# EAGLE design E-Piano-SM (EAGLE 9.2.2)
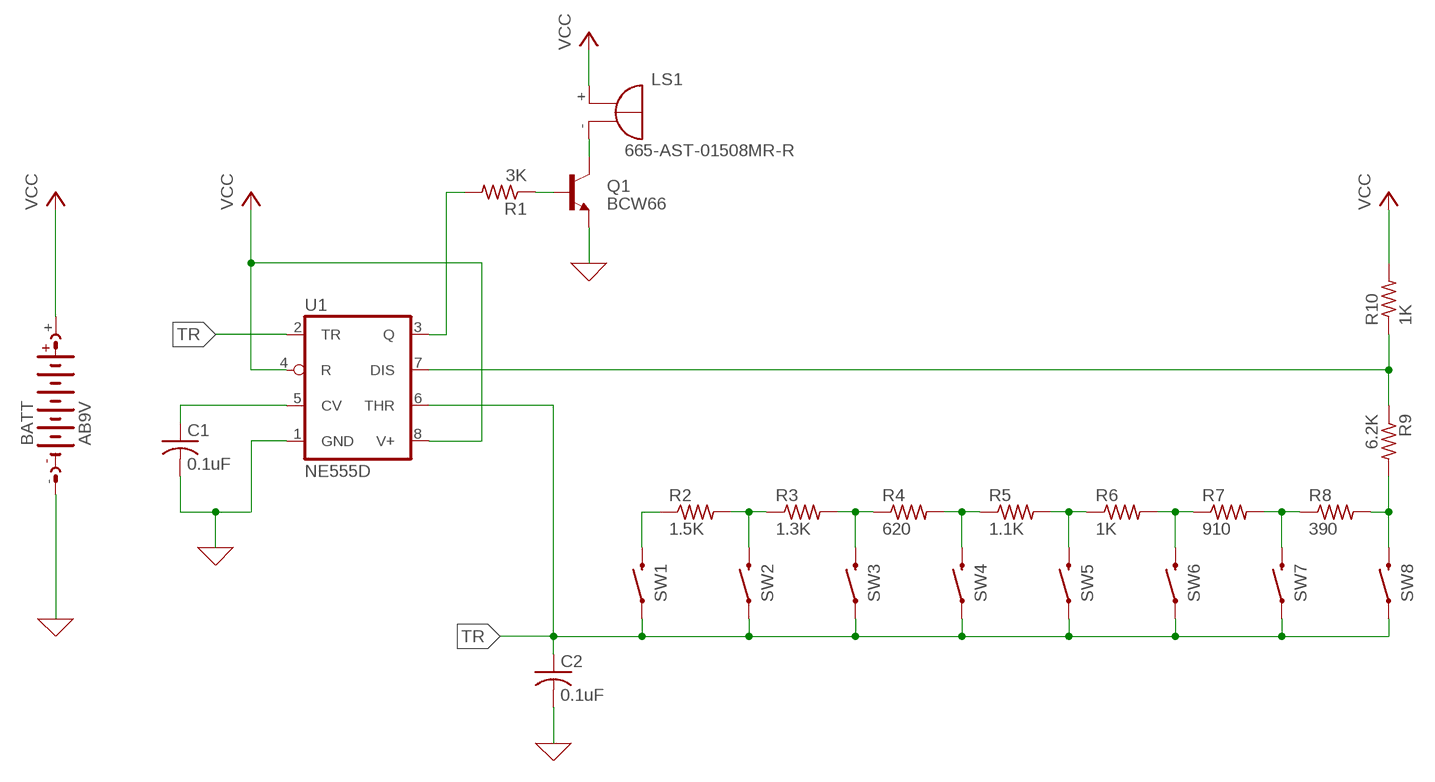
[diagram p0: schematic, sheet 1]

## Parts
BATT  AB9V  [AB9V]
C1  0.1uF  C-USC0805  [C0805]
C2  0.1uF  C-USC0805  [C0805]
LS1  F/HMB  [F/HMB]
Q1  BCW66  BCW60-NPN-SOT23-BEC  [SOT23-BEC]
R1  3K  R-US_R0805  [R0805]
R2  1.5K  R-US_R0805  [R0805]
R3  1.3K  R-US_R0805  [R0805]
R4  620  R-US_R0805  [R0805]
R5  1.1K  R-US_R0805  [R0805]
R6  1K  R-US_R0805  [R0805]
R7  910  R-US_R0805  [R0805]
R8  390  R-US_R0805  [R0805]
R9  6.2K  R-US_R0805  [R0805]
R10  1K  R-US_R0805  [R0805]
SW1  MOMENTARY-SWITCH-SPST-SMD-6.2MM-TALL  [TACTILE_SWITCH_SMD_6.2MM_TALL]
SW2  MOMENTARY-SWITCH-SPST-SMD-6.2MM-TALL  [TACTILE_SWITCH_SMD_6.2MM_TALL]
SW3  MOMENTARY-SWITCH-SPST-SMD-6.2MM-TALL  [TACTILE_SWITCH_SMD_6.2MM_TALL]
SW4  MOMENTARY-SWITCH-SPST-SMD-6.2MM-TALL  [TACTILE_SWITCH_SMD_6.2MM_TALL]
SW5  MOMENTARY-SWITCH-SPST-SMD-6.2MM-TALL  [TACTILE_SWITCH_SMD_6.2MM_TALL]
SW6  MOMENTARY-SWITCH-SPST-SMD-6.2MM-TALL  [TACTILE_SWITCH_SMD_6.2MM_TALL]
SW7  MOMENTARY-SWITCH-SPST-SMD-6.2MM-TALL  [TACTILE_SWITCH_SMD_6.2MM_TALL]
SW8  MOMENTARY-SWITCH-SPST-SMD-6.2MM-TALL  [TACTILE_SWITCH_SMD_6.2MM_TALL]
U1  NE555D  [SO08]

## Nets
0: BATT.- C1.2 C2.2 Q1.E U1.1(GND) ; supply symbol labelled GND
N$1: R8.2 R9.2 SW8.B2
N$2: R9.1 R10.1 U1.7(DIS)
N$3: R2.1 SW1.B2
N$4: R7.2 R8.1 SW7.B2
N$5: R6.2 R7.1 SW6.B2
N$6: R5.2 R6.1 SW5.B2
N$7: R4.2 R5.1 SW4.B2
N$8: R3.2 R4.1 SW3.B2
N$9: R2.2 R3.1 SW2.B2
N$11: R1.2 U1.3(Q)
N$12: C1.1 U1.5(CV)
N$13: LS1.- Q1.C
N$14: Q1.B R1.1
TR: C2.1 SW1.A2 SW2.A2 SW3.A2 SW4.A2 SW5.A2 SW6.A2 SW7.A2 SW8.A2 U1.2(TR) U1.6(THR)
VCC: BATT.+ LS1.+ R10.2 U1.4(R) U1.8(V+)

## Library data of the parts
BATT = battery:AB9V: 9-V BATTERY CLIP; MOUSER#: 534-81-8TB; MPN: 81-8; OC_NEWARK: unknown
C1 C2 = rcl:C-US: CAPACITOR, American symbol; MOUSER#: 603-CC805JRX7R9BB104; MPN: CC805JRX7R9BB104; OC_NEWARK: unknown; SPICEPREFIX: C
LS1 = buzzer:F/HMB: BUZZER Source: Buerklin; MOUSER#: 665-AST-01508MR-R; OC_FARNELL: unknown; OC_NEWARK: unknown
Q1 = transistor:*-NPN-: NPN Transistror BF959 corrected 2008.03.06; MF: FAIRCHILD SEMICONDUCTOR; MOUSER#: 726-BCW66KHE6327HTSA; MPN: PN2222ATF; OC_NEWARK: 58K2048
R1 R6 R10 = rcl:R-US_: RESISTOR, American symbol; MOUSER#: 652-CR0805FX-1001ELF; OC_NEWARK: unknown; SPICEPREFIX: R
R2 = rcl:R-US_: RESISTOR, American symbol; MOUSER#: 652-CR0805FX-1501ELF; OC_NEWARK: unknown; SPICEPREFIX: R
R3 = rcl:R-US_: RESISTOR, American symbol; MOUSER#: 652-CR0805JW-132ELF; OC_NEWARK: unknown; SPICEPREFIX: R
R4 = rcl:R-US_: RESISTOR, American symbol; MOUSER#: 652-CR0805JW-621ELF; OC_NEWARK: unknown; SPICEPREFIX: R
R5 = rcl:R-US_: RESISTOR, American symbol; MOUSER#: 652-CR0805FX-1101ELF; OC_NEWARK: unknown; SPICEPREFIX: R
R7 = rcl:R-US_: RESISTOR, American symbol; MOUSER#: 652-CR0805FX-9100ELF; OC_NEWARK: unknown; SPICEPREFIX: R
R8 = rcl:R-US_: RESISTOR, American symbol; MOUSER#: 652-CR0805JW-391ELF; OC_NEWARK: unknown; SPICEPREFIX: R
R9 = rcl:R-US_: RESISTOR, American symbol; MOUSER#: 652-CR0805FX-6201ELF; OC_NEWARK: unknown; SPICEPREFIX: R
SW1-SW8 = SparkFun-Switches:MOMENTARY-SWITCH-SPST: Momentary Switch (Pushbutton) - SPST Normally-open (NO) SPST momentary switches (buttons, pushbuttons). Variants PTH-12MM - 12mm square, through-hole Momentary Pushbutton Switch - 12mm Square <https://www.sparkfun.com/products/9190> (COM-09190) PTH-6.0MM, PTH-6.0MM-KIT - 6.0mm square, through-hole Mini Pushbutton Switch <https://www.sparkfun.com/products/97> (COM-00097) KIT package intended for soldering kit's - only one side of pads' copper is exposed. PTH-RIGHT-ANGLE-KIT - Right-angle, through-hole Right Angle Tactile Button <https://www.sparkfun.com/products/10791> - Used on SparkFun BigTime Watch Kit <https://www.sparkfun.com/products/11734> SMD-12MM - 12mm square, surface-mount Tactile Button - SMD (12mm) <https://www.sparkfun.com/products/12993> (COM-12993) Used on SparkFun PicoBoard <https://www.sparkfun.com/products/11888> SMD-4.5MM - 4.5mm Square Trackball Switch Used on SparkFun Blackberry Trackballer Breakout <https://www.sparkfun.com/products/13169> SMD-4.6MMX2.8MM - 4.60mm x 2.80mm, surface mount Used on SparkFun SAMD21 Mini Breakout <https://www.sparkfun.com/products/13664> SMD-5.2MM, SMD-5.2-REDUNDANT - 5.2mm square, surface-mount Mini Pushbutton Switch - SMD <https://www.sparkfun.com/products/8720> (COM-08720) Used on Arduino Pro Mini <https://www.sparkfun.com/products/11114> REDUNDANT package connects both switch circuits together SMD-6.0X3.5MM - 6.0 x 3.5mm, surface mount Momentary Reset Switch SMD <https://www.sparkfun.com/products/8229> (COM-08229) SMD-6.2MM-TALL - 6.2mm square, surface mount Tactile Button - SMD (6mm) <https://www.sparkfun.com/products/12992> Used on SparkFun Digital Sandbox <https://www.sparkfun.com/products/12651> SMD-RIGHT-ANGLE - Right-angle, surface mount Used on SparkFun Block for Intel® Edison - Arduino <https://www.sparkfun.com/products/13036>; MOUSER#: 693-1301.9317; MPN: 1301.9317; OC_NEWARK: unknown; PROD_ID: SWCH-11966; SF_SKU: COM-12992
U1 = linear:*555: TIMER; MOUSER#: 595-TLC555CDR; OC_NEWARK: unknown

## Net classes
0 default: width 0.305 mm, drill 0.508 mm, clearance 0.254 mm

## Board
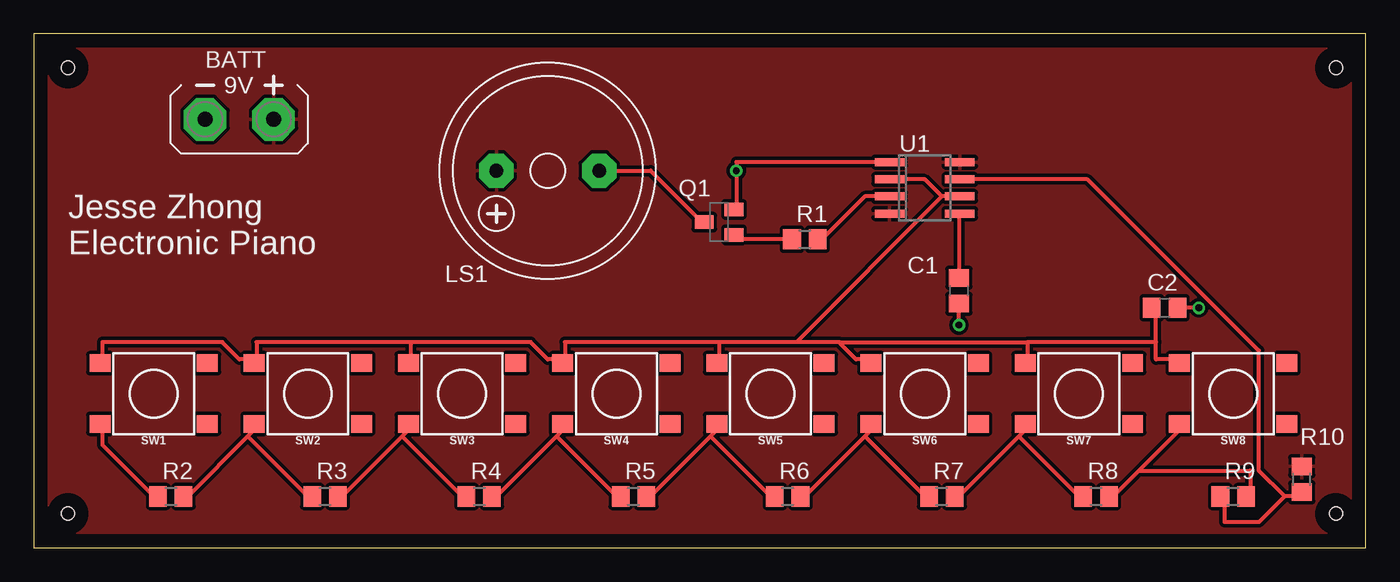
[diagram p1: board, top side]
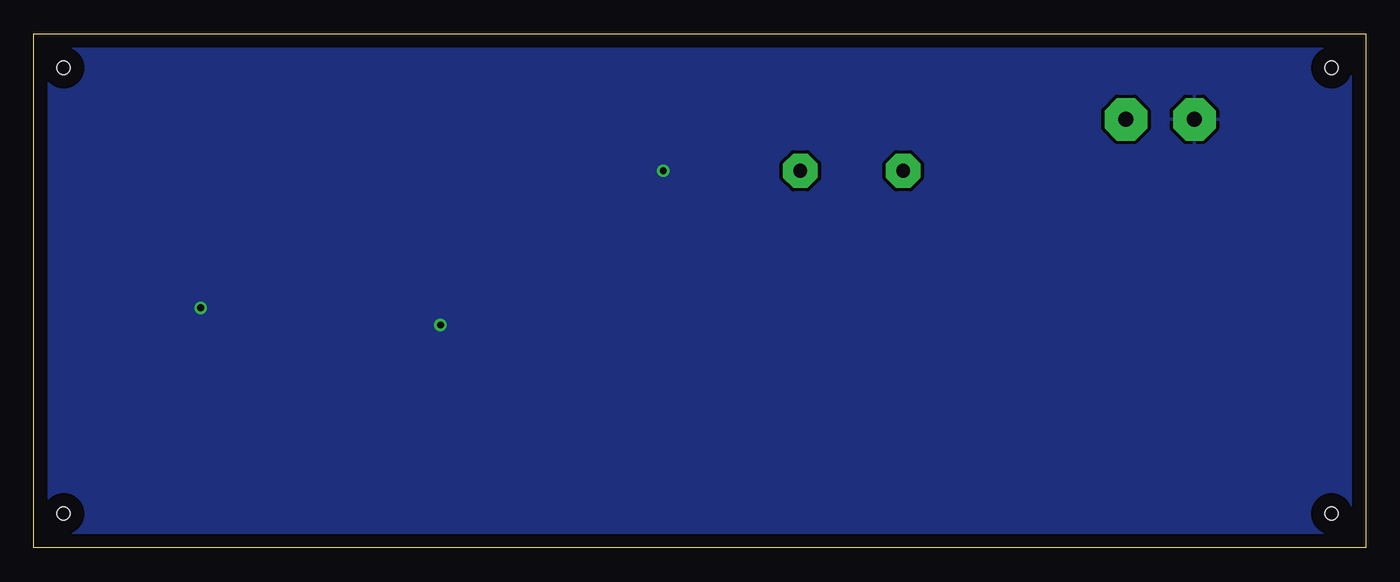
[diagram p2: board, bottom side, seen from below]

Size 98.73 x 38.09 mm. Coordinates in mm from the lower left corner, seen from the top.
Outline: 0,0 98.73,0 98.73,38.09 0,38.09 0,0
Copper layers (1*16): Top 0.035mm / dielectric 1.5mm / Bottom 0.035mm
Design rules "default": minimum track width 6mil, minimum drill 0.35mm, track to track 6mil, track to pad 6mil, pad to pad 6mil, via to via 6mil, smd to smd 6mil, copper to edge 40mil, drill to drill 6mil, minimum pad ring 10mil, minimum via ring 8mil, stop-mask expansion 4mil, vias tented up to drill 0mil, thermal gap 10mil
Holes 1 mm at 2.54,35.56 2.54,2.54 96.52,2.54 96.52,35.56

### Footprints (pad centres in the part's own frame; a part is rotated, then mirrored left to right if it is on the bottom)
AB9V = drill 1.118 pad 3.15 octagon: + 0,2.54; - 0,-2.54
C0805 = smd 1.3 x 1.5: 1 -0.95,0; 2 0.95,0
F/HMB = drill 1.016 pad 2.54 octagon: + 3.81,0; - -3.81,0
SOT23-BEC = smd 1 x 1.4: B -0.95,-1.1; C 0,1.1; E 0.95,-1.1
R0805 = smd 1.3 x 1.5: 1 -0.95,0; 2 0.95,0
TACTILE_SWITCH_SMD_6.2MM_TALL = smd 1.55 x 1.3: A1 -3.975,-2.25; A2 3.975,-2.25; B1 -3.975,2.25; B2 3.975,2.25
SO08 = smd 0.6 x 2.2: 1 -1.905,-2.6; 2 -0.635,-2.6; 3 0.635,-2.6; 4 1.905,-2.6; 5 1.905,2.6; 6 0.635,2.6; 7 -0.635,2.6; 8 -1.905,2.6

### Placement (x,y rotation side)
BATT  15.24,31.75 270 top
C1  68.58,19.05 270 top
C2  83.82,17.78 0 top
LS1  38.1,27.94 180 top
Q1  50.8,24.13 90 top
R1  57.15,22.86 0 top
R2  10.16,3.81 0 top
R3  21.59,3.81 0 top
R4  33.02,3.81 0 top
R5  44.45,3.81 0 top
R6  55.88,3.81 0 top
R7  67.31,3.81 0 top
R8  78.74,3.81 0 top
R9  88.9,3.81 0 top
R10  93.98,5.08 90 top
SW1  8.89,11.43 180 top
SW2  20.32,11.43 180 top
SW3  31.75,11.43 180 top
SW4  43.18,11.43 180 top
SW5  54.61,11.43 180 top
SW6  66.04,11.43 180 top
SW7  77.47,11.43 180 top
SW8  88.9,11.43 180 top
U1  66.04,26.67 270 top

### Tracks (layer width: path | path; a pad name or v marks a point on that pad's centre or on a via)
0  (via drill 0.51)
  Top 0.305: U1.1 52.07,28.57 v52.07,27.94 52.07,25.4 Q1.E | v68.58,16.51 C1.2 | v86.36,17.78 C2.2
  pour Bottom: 0,-1.27 99.06,-1.27 99.06,39.37 -1.27,39.37 -1.27,-1.27
N$1
  Top 0.305: 81.92,5.71 85.09,8.89 SW8.B2 | 81.92,5.71 80.01,3.81 R8.2 | 81.92,5.71 90.17,5.71 90.17,3.81 R9.2
N$2
  Top 0.305: 92.71,3.81 90.81,1.91 88.27,1.91 88.27,3.81 R9.1 | 92.71,3.81 93.98,3.81 R10.1 | U1.7 78.11,27.3 90.81,14.61 90.81,5.71 92.71,3.81
N$3
  Top 0.305: R2.1 8.89,3.81 5.08,7.62 5.08,8.89 SW1.B2
N$4
  Top 0.305: 73.03,8.26 73.66,8.89 SW7.B2 | 73.03,8.26 68.58,3.81 R7.2 | 73.03,8.26 77.47,3.81 R8.1
N$5
  Top 0.305: 61.59,8.26 62.23,8.89 SW6.B2 | 61.59,8.26 57.15,3.81 R6.2 | 61.59,8.26 66.04,3.81 R7.1
N$6
  Top 0.305: 50.16,8.26 50.8,8.89 SW5.B2 | 50.16,8.26 45.72,3.81 R5.2 | 50.16,8.26 54.61,3.81 R6.1
N$7
  Top 0.305: 38.73,8.26 39.37,8.89 SW4.B2 | 38.73,8.26 34.29,3.81 R4.2 | 38.73,8.26 43.18,3.81 R5.1
N$8
  Top 0.305: 27.3,8.26 27.94,8.89 SW3.B2 | 27.3,8.26 22.86,3.81 R3.2 | 27.3,8.26 31.75,3.81 R4.1
N$9
  Top 0.305: 15.88,8.26 16.51,8.89 SW2.B2 | 15.88,8.26 11.43,3.81 R2.2 | 15.88,8.26 20.32,3.81 R3.1
N$11
  Top 0.305: U1.3 61.59,26.04 58.42,22.86 R1.2
N$12
  Top 0.305: C1.1 68.58,24.77 U1.5
N$13
  Top 0.305: LS1.- 45.72,27.94 49.53,24.13 Q1.C
N$14
  Top 0.305: R1.1 52.07,22.86 Q1.B
TR
  Top 0.305: SW1.A2 5.08,13.97 5.08,15.24 13.97,15.24 15.24,13.97 15.88,13.97 SW2.A2 16.51,13.97 16.51,15.24 27.94,15.24 | 27.94,15.24 27.94,13.97 SW3.A2 | 27.94,15.24 36.83,15.24 38.1,13.97 38.73,13.97 SW4.A2 39.37,13.97 39.37,15.24 50.8,15.24 | 83.19,15.24 83.19,13.97 84.45,13.97 SW8.A2 | 83.19,15.24 83.19,17.78 C2.1 | 73.66,15.24 73.66,13.97 SW7.A2 | 83.19,15.24 73.66,15.24 | U1.2 66.04,27.3 67.31,26.04 | U1.6 67.31,26.04 | 50.8,15.24 50.8,13.97 SW5.A2 | 59.69,15.24 56.52,15.24 | 56.52,15.24 50.8,15.24 | 59.69,15.24 60.96,13.97 61.59,13.97 SW6.A2 | 56.52,15.24 67.31,26.04 | 59.69,15.24 73.66,15.24
VCC
  pour Top: -1.27,-1.27 100.33,-1.27 100.33,39.37 -1.27,39.37

### Text on the board
tPlace: Jesse Zhong / Electronic Piano